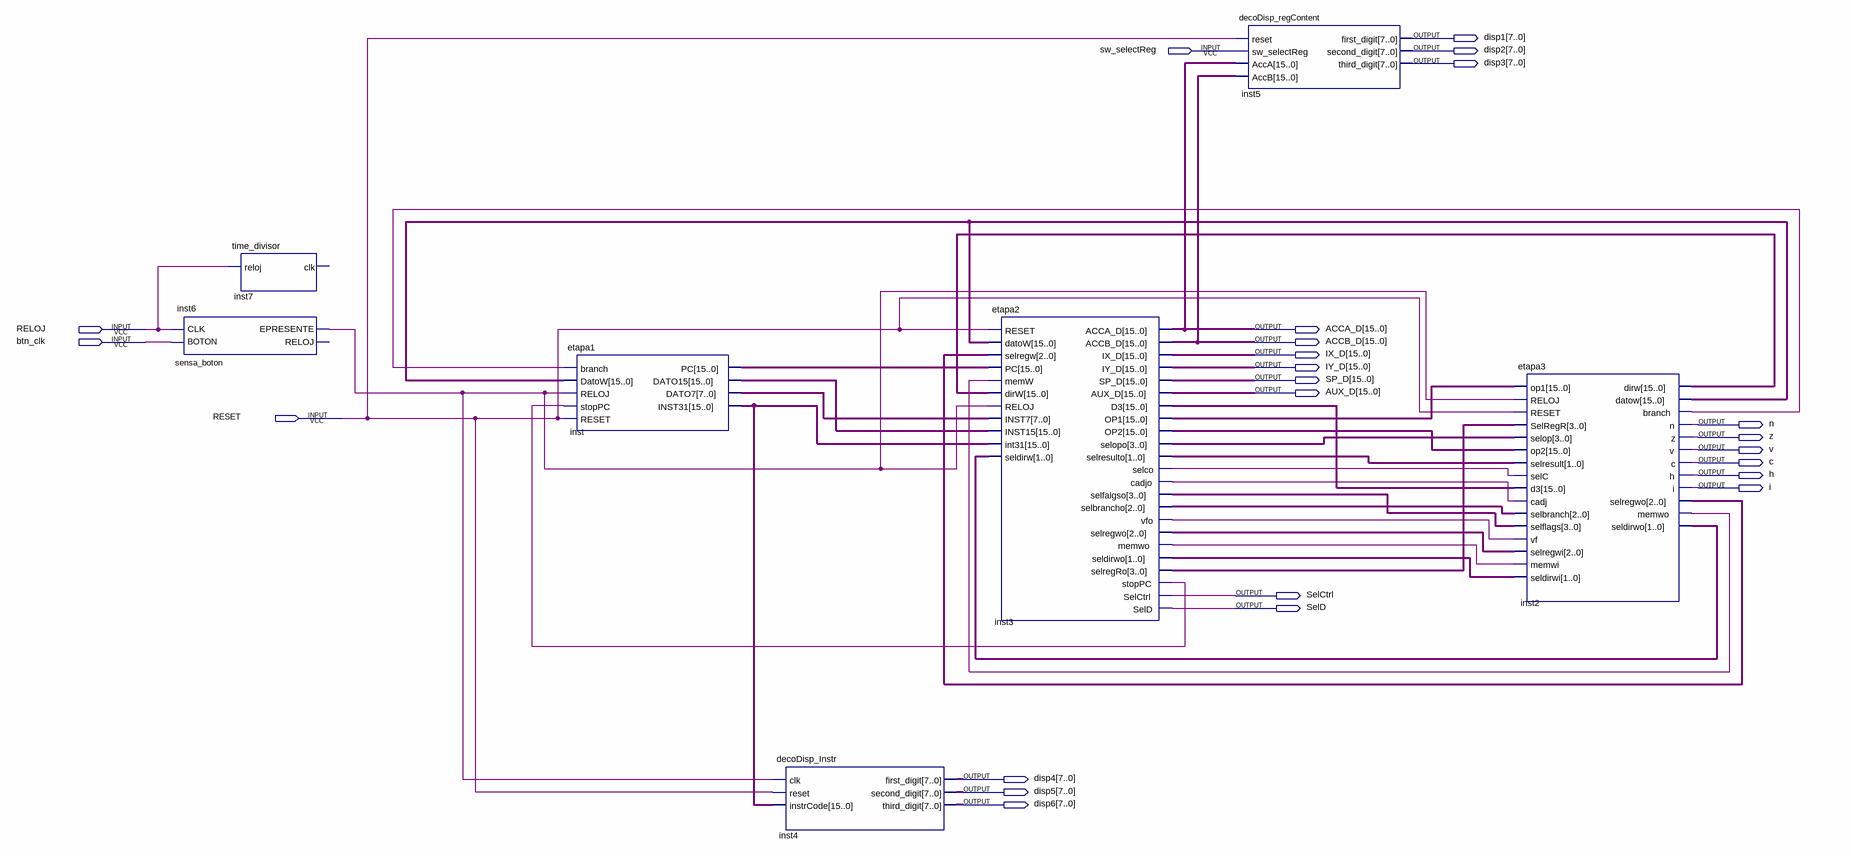
[diagram p0: schematic sheet]
// Quartus schematic pipeline.bdf as structural Verilog: 7 symbols, 24 pins
module pipeline (
  input  sw_selectReg,
  input  RELOJ,
  input  btn_clk,
  input  RESET,
  output [7:0] disp1,
  output [7:0] disp2,
  output [7:0] disp3,
  output [15:0] ACCA_D,
  output [15:0] ACCB_D,
  output [15:0] IX_D,
  output [15:0] IY_D,
  output [15:0] SP_D,
  output [15:0] AUX_D,
  output n,
  output z,
  output v,
  output c,
  output h,
  output i,
  output SelCtrl,
  output SelD,
  output [7:0] disp4,
  output [7:0] disp5,
  output [7:0] disp6
);

  wire inst2_branch, inst2_memwo, inst3_cadjo, inst3_memwo, inst3_selco, inst3_stoppc, inst3_vfo,
       inst6_epresente;
  wire [1:0] inst2_seldirwo, inst3_seldirwo, inst3_selresulto;
  wire [2:0] inst2_selregwo, inst3_selbrancho, inst3_selregwo;
  wire [3:0] inst3_selfalgso, inst3_selopo, inst3_selregro;
  wire [7:0] inst_dato7;
  wire [15:0] inst2_datow, inst2_dirw, inst3_d3, inst3_op1, inst3_op2, inst_dato15, inst_inst31, inst_pc;

  sensa_boton inst6 (.BOTON(btn_clk), .CLK(RELOJ), .EPRESENTE(inst6_epresente));  // open: RELOJ
  time_divisor inst7 (.reloj(RELOJ));  // open: clk
  etapa1 inst (
    .branch(inst2_branch), .DatoW(inst2_datow), .RELOJ(inst6_epresente), .stopPC(inst3_stoppc),
    .RESET(RESET), .PC(inst_pc), .DATO15(inst_dato15), .DATO7(inst_dato7), .INST31(inst_inst31));
  decoDisp_Instr inst4 (
    .clk(inst6_epresente), .reset(RESET), .instrCode(inst_inst31), .first_digit(disp4), .second_digit(disp5),
    .third_digit(disp6));
  etapa2 inst3 (
    .RESET(RESET), .datoW(inst2_datow), .selregw(inst2_selregwo), .PC(inst_pc), .memW(inst2_memwo),
    .dirW(inst2_dirw), .RELOJ(inst6_epresente), .INST7(inst_dato7), .INST15(inst_dato15),
    .int31(inst_inst31), .seldirw(inst2_seldirwo), .ACCA_D(ACCA_D), .ACCB_D(ACCB_D), .IX_D(IX_D),
    .IY_D(IY_D), .SP_D(SP_D), .AUX_D(AUX_D), .D3(inst3_d3), .OP1(inst3_op1), .OP2(inst3_op2),
    .selopo(inst3_selopo), .selresulto(inst3_selresulto), .selco(inst3_selco), .cadjo(inst3_cadjo),
    .selfalgso(inst3_selfalgso), .selbrancho(inst3_selbrancho), .vfo(inst3_vfo), .selregwo(inst3_selregwo),
    .memwo(inst3_memwo), .seldirwo(inst3_seldirwo), .selregRo(inst3_selregro), .stopPC(inst3_stoppc),
    .SelCtrl(SelCtrl), .SelD(SelD));
  decoDisp_regContent inst5 (
    .reset(RESET), .sw_selectReg(sw_selectReg), .AccA(ACCA_D), .AccB(ACCB_D), .first_digit(disp1),
    .second_digit(disp2), .third_digit(disp3));
  etapa3 inst2 (
    .op1(inst3_op1), .RELOJ(inst6_epresente), .RESET(RESET), .SelRegR(inst3_selregro), .selop(inst3_selopo),
    .op2(inst3_op2), .selresult(inst3_selresulto), .selC(inst3_selco), .d3(inst3_d3), .cadj(inst3_cadjo),
    .selbranch(inst3_selbrancho), .selflags(inst3_selfalgso), .vf(inst3_vfo), .selregwi(inst3_selregwo),
    .memwi(inst3_memwo), .seldirwi(inst3_seldirwo), .dirw(inst2_dirw), .datow(inst2_datow),
    .branch(inst2_branch), .n(n), .z(z), .v(v), .c(c), .h(h), .i(i), .selregwo(inst2_selregwo),
    .memwo(inst2_memwo), .seldirwo(inst2_seldirwo));
endmodule
